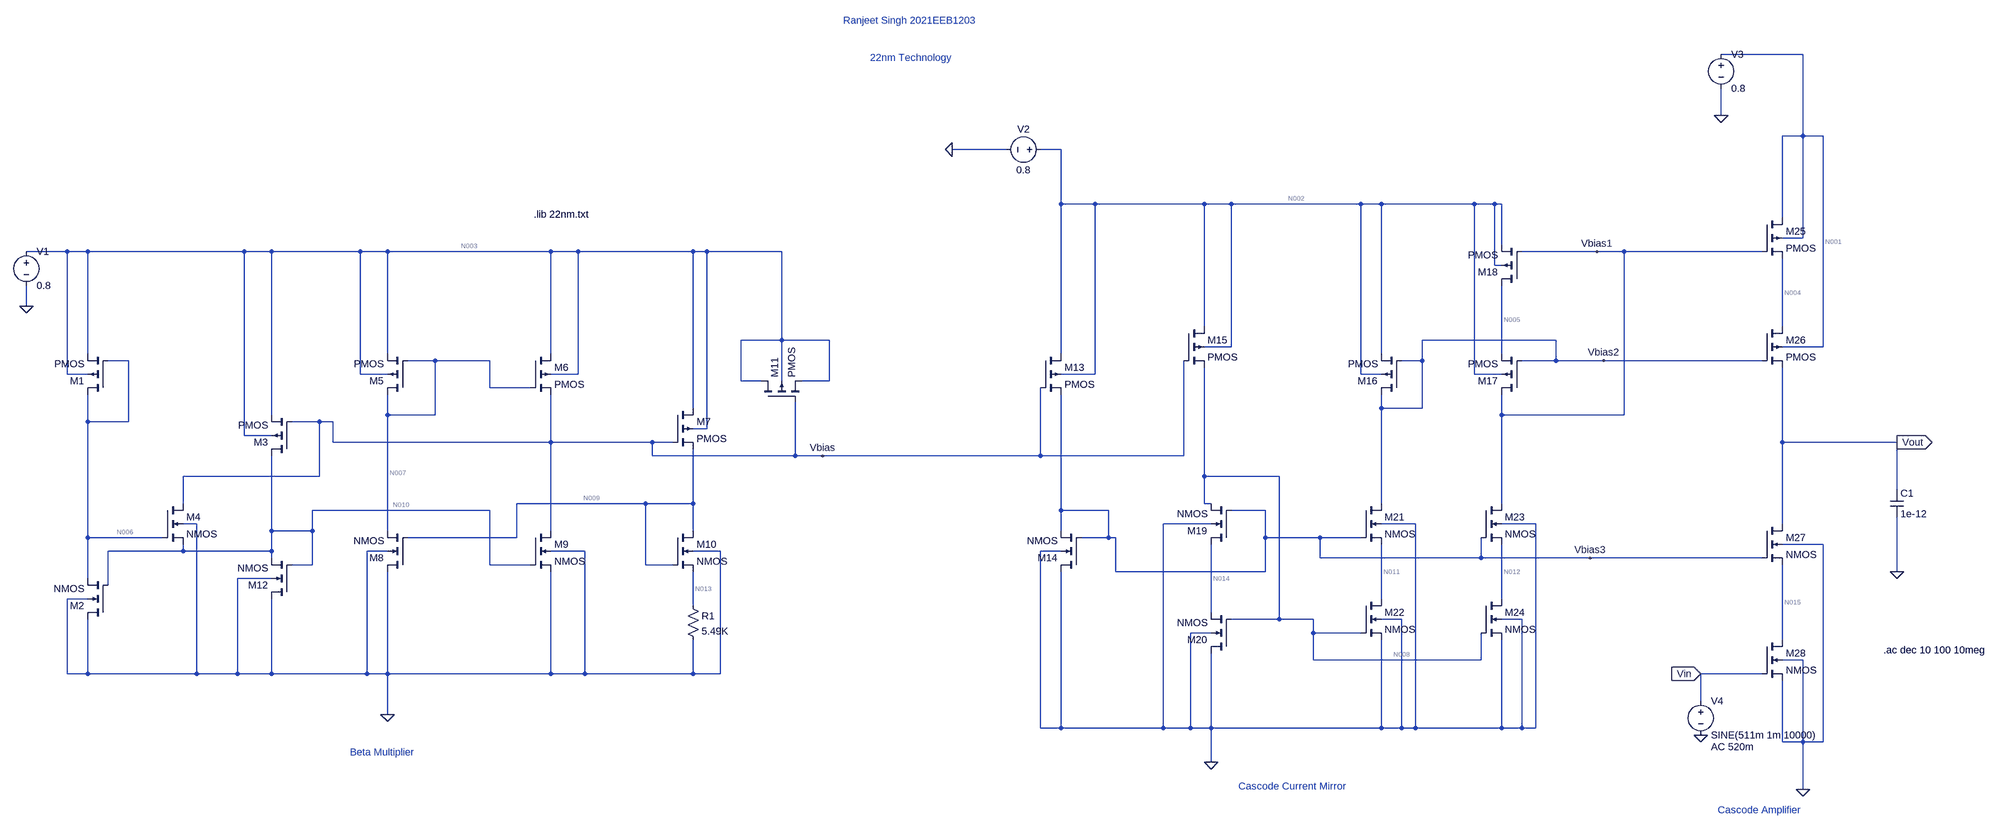
[diagram p0: schematic 22nm.asc]
22nm.asc, the LTspice schematic file:
Version 4
SHEET 1 3836 1104
WIRE 3344 -688 3152 -688
WIRE 3152 -544 3152 -608
WIRE 3344 -496 3344 -688
WIRE 3344 -496 3296 -496
WIRE 3392 -496 3344 -496
WIRE 1152 -464 1024 -464
WIRE 1280 -464 1232 -464
WIRE 1280 -336 1280 -464
WIRE 1360 -336 1280 -336
WIRE 1648 -336 1360 -336
WIRE 1712 -336 1648 -336
WIRE 2016 -336 1712 -336
WIRE 2064 -336 2016 -336
WIRE 2304 -336 2064 -336
WIRE 2352 -336 2304 -336
WIRE 2368 -336 2352 -336
WIRE 3296 -304 3296 -496
WIRE 3344 -256 3344 -496
WIRE 3344 -256 3296 -256
WIRE 2368 -240 2368 -336
WIRE -1104 -224 -1200 -224
WIRE -1056 -224 -1104 -224
WIRE -688 -224 -1056 -224
WIRE -624 -224 -688 -224
WIRE -416 -224 -624 -224
WIRE -352 -224 -416 -224
WIRE 32 -224 -352 -224
WIRE 96 -224 32 -224
WIRE 416 -224 96 -224
WIRE 448 -224 416 -224
WIRE 624 -224 448 -224
WIRE 2592 -224 2416 -224
WIRE 2656 -224 2592 -224
WIRE 3248 -224 2656 -224
WIRE 2352 -192 2352 -336
WIRE 2368 -192 2352 -192
WIRE -1200 -96 -1200 -144
WIRE 1648 -48 1648 -336
WIRE 3296 -48 3296 -208
WIRE 624 -16 624 -224
WIRE 624 -16 528 -16
WIRE 736 -16 624 -16
WIRE 2496 -16 2160 -16
WIRE 1712 0 1712 -336
WIRE 1712 0 1648 0
WIRE 3392 0 3392 -496
WIRE 3392 0 3296 0
WIRE -1056 16 -1056 -224
WIRE -352 16 -352 -224
WIRE 32 16 32 -224
WIRE 1280 16 1280 -336
WIRE 2064 16 2064 -336
WIRE 2368 16 2368 -144
WIRE -960 32 -1008 32
WIRE -240 32 -304 32
WIRE -112 32 -240 32
WIRE 2160 32 2160 -16
WIRE 2160 32 2112 32
WIRE 2496 32 2496 -16
WIRE 2496 32 2416 32
WIRE 2608 32 2496 32
WIRE 3248 32 2608 32
WIRE -1104 64 -1104 -224
WIRE -1056 64 -1104 64
WIRE -416 64 -416 -224
WIRE -352 64 -416 64
WIRE 96 64 96 -224
WIRE 96 64 32 64
WIRE 1360 64 1360 -336
WIRE 1360 64 1280 64
WIRE 2016 64 2016 -336
WIRE 2064 64 2016 64
WIRE 2304 64 2304 -336
WIRE 2368 64 2304 64
WIRE 528 80 528 -16
WIRE 576 80 528 80
WIRE 624 80 624 -16
WIRE 736 80 736 -16
WIRE 736 80 672 80
WIRE -112 96 -112 32
WIRE -16 96 -112 96
WIRE 416 144 416 -224
WIRE 2064 144 2064 112
WIRE 2160 144 2160 32
WIRE 2160 144 2064 144
WIRE -624 160 -624 -224
WIRE -352 160 -352 112
WIRE -240 160 -240 32
WIRE -240 160 -352 160
WIRE 2368 160 2368 112
WIRE 2656 160 2656 -224
WIRE 2656 160 2368 160
WIRE -1056 176 -1056 112
WIRE -960 176 -960 32
WIRE -960 176 -1056 176
WIRE -512 176 -576 176
WIRE -480 176 -512 176
WIRE 448 192 448 -224
WIRE 448 192 416 192
WIRE -688 208 -688 -224
WIRE -624 208 -688 208
WIRE -480 224 -480 176
WIRE 32 224 32 112
WIRE 32 224 -480 224
WIRE 320 224 32 224
WIRE 368 224 320 224
WIRE 3296 224 3296 48
WIRE 3600 224 3296 224
WIRE 320 256 320 224
WIRE 656 256 656 128
WIRE 656 256 320 256
WIRE 720 256 656 256
WIRE 1232 256 1232 96
WIRE 1232 256 720 256
WIRE 1600 256 1600 32
WIRE 1600 256 1232 256
WIRE -512 304 -512 176
WIRE -512 304 -832 304
WIRE 1648 304 1648 48
WIRE 1824 304 1648 304
WIRE 3600 336 3600 224
WIRE -832 368 -832 304
WIRE 304 368 -48 368
WIRE 416 368 416 240
WIRE 416 368 304 368
WIRE 1648 368 1648 304
WIRE 1664 368 1648 368
WIRE 2064 368 2064 144
WIRE 2368 368 2368 160
WIRE -112 384 -528 384
WIRE 1280 384 1280 112
WIRE 1392 384 1280 384
WIRE 1792 384 1712 384
WIRE -800 416 -832 416
WIRE 1664 416 1552 416
WIRE 2144 416 2064 416
WIRE 2448 416 2368 416
WIRE 3296 416 3296 224
WIRE -624 432 -624 256
WIRE -528 432 -528 384
WIRE -528 432 -624 432
WIRE -352 432 -352 160
WIRE 32 432 32 224
WIRE 416 432 416 368
WIRE 1280 432 1280 384
WIRE -1056 448 -1056 176
WIRE -880 448 -1056 448
WIRE -48 448 -48 368
WIRE -48 448 -304 448
WIRE 1392 448 1392 384
WIRE 1392 448 1328 448
WIRE 1408 448 1392 448
WIRE 1792 448 1792 384
WIRE 1920 448 1792 448
WIRE 2016 448 1920 448
WIRE 3392 464 3296 464
WIRE -832 480 -832 464
WIRE -832 480 -1008 480
WIRE -624 480 -624 432
WIRE -624 480 -832 480
WIRE -352 480 -400 480
WIRE 112 480 32 480
WIRE 480 480 416 480
WIRE 1280 480 1232 480
WIRE -624 496 -624 480
WIRE 1920 496 1920 448
WIRE 2320 496 2320 448
WIRE 2320 496 1920 496
WIRE 2576 496 2320 496
WIRE 3248 496 2576 496
WIRE -528 512 -528 432
WIRE -528 512 -576 512
WIRE -112 512 -112 384
WIRE -16 512 -112 512
WIRE 304 512 304 368
WIRE 368 512 304 512
WIRE 1408 528 1408 448
WIRE 1792 528 1792 448
WIRE 1792 528 1408 528
WIRE 3600 528 3600 400
WIRE -1056 544 -1056 448
WIRE -624 544 -704 544
WIRE -1008 560 -1008 480
WIRE -1056 592 -1104 592
WIRE 2064 592 2064 464
WIRE 2368 592 2368 464
WIRE 416 608 416 528
WIRE 1664 624 1664 464
WIRE 1824 640 1824 304
WIRE 1824 640 1712 640
WIRE 1904 640 1824 640
WIRE 2112 640 2064 640
WIRE 2416 640 2368 640
WIRE 1664 672 1616 672
WIRE 1904 672 1904 640
WIRE 2016 672 1904 672
WIRE 3296 688 3296 512
WIRE 1904 736 1904 672
WIRE 2320 736 2320 672
WIRE 2320 736 1904 736
WIRE 3344 736 3296 736
WIRE -1104 768 -1104 592
WIRE -1056 768 -1056 640
WIRE -1056 768 -1104 768
WIRE -800 768 -800 416
WIRE -800 768 -1056 768
WIRE -704 768 -704 544
WIRE -704 768 -800 768
WIRE -624 768 -624 592
WIRE -624 768 -704 768
WIRE -400 768 -400 480
WIRE -400 768 -624 768
WIRE -352 768 -352 528
WIRE -352 768 -400 768
WIRE 32 768 32 528
WIRE 32 768 -352 768
WIRE 112 768 112 480
WIRE 112 768 32 768
WIRE 416 768 416 688
WIRE 416 768 112 768
WIRE 480 768 480 480
WIRE 480 768 416 768
WIRE 3248 768 3104 768
WIRE 3104 832 3104 768
WIRE -352 864 -352 768
WIRE 1232 896 1232 480
WIRE 1280 896 1280 528
WIRE 1280 896 1232 896
WIRE 1552 896 1552 416
WIRE 1552 896 1280 896
WIRE 1616 896 1616 672
WIRE 1616 896 1552 896
WIRE 1664 896 1664 720
WIRE 1664 896 1616 896
WIRE 2064 896 2064 688
WIRE 2064 896 1664 896
WIRE 2112 896 2112 640
WIRE 2112 896 2064 896
WIRE 2144 896 2144 416
WIRE 2144 896 2112 896
WIRE 2368 896 2368 688
WIRE 2368 896 2144 896
WIRE 2416 896 2416 640
WIRE 2416 896 2368 896
WIRE 2448 896 2448 416
WIRE 2448 896 2416 896
WIRE 3296 928 3296 784
WIRE 3344 928 3344 736
WIRE 3344 928 3296 928
WIRE 3392 928 3392 464
WIRE 3392 928 3344 928
WIRE 1664 976 1664 896
WIRE 3344 1040 3344 928
FLAG -1200 -96 0
FLAG -352 864 0
FLAG 720 256 Vbias
FLAG 2592 -224 Vbias1
FLAG 2608 32 Vbias2
FLAG 2576 496 Vbias3
FLAG 1024 -464 0
FLAG 1664 976 0
FLAG 3600 528 0
FLAG 3344 1040 0
FLAG 3152 -544 0
FLAG 3104 912 0
FLAG 3600 224 Vout
IOPIN 3600 224 Out
FLAG 3104 768 Vin
IOPIN 3104 768 In
DATAFLAG 1968 496 ""
DATAFLAG 2848 32 ""
DATAFLAG 2896 -224 ""
DATAFLAG 2928 496 ""
DATAFLAG 1232 752 ""
DATAFLAG 3296 -112 ""
DATAFLAG 3296 304 ""
DATAFLAG 3296 608 ""
DATAFLAG 3184 768 ""
DATAFLAG 976 256 ""
DATAFLAG 3344 -608 ""
SYMBOL pmos4 -1008 112 R180
SYMATTR InstName M1
SYMATTR Value2 l=440n w=220n
SYMBOL nmos4 -1008 640 R180
SYMATTR InstName M2
SYMATTR Value2 l=44n w=220n
SYMBOL pmos4 -576 256 R180
SYMATTR InstName M3
SYMATTR Value2 l=44n w=528n
SYMBOL nmos4 -880 368 R0
SYMATTR InstName M4
SYMATTR Value2 l=44n w=88n
SYMBOL pmos4 -304 112 R180
SYMATTR InstName M5
SYMATTR Value2 l=44n w=528n
SYMBOL pmos4 -16 16 R0
SYMATTR InstName M6
SYMATTR Value2 l=44n w=528n
SYMBOL pmos4 368 144 R0
SYMATTR InstName M7
SYMATTR Value2 l=44n w=528n
SYMBOL nmos4 -304 528 R180
SYMATTR InstName M8
SYMATTR Value2 l=44n w=220n
SYMBOL nmos4 -16 432 R0
SYMATTR InstName M9
SYMATTR Value2 l=44n w=220n
SYMBOL nmos4 368 432 R0
SYMATTR InstName M10
SYMATTR Value2 l=44n w=660n
SYMBOL pmos4 576 128 R270
SYMATTR InstName M11
SYMBOL nmos4 -576 592 R180
SYMATTR InstName M12
SYMATTR Value2 l=44n w=220n
SYMBOL voltage -1200 -240 R0
WINDOW 123 0 0 Left 0
WINDOW 39 0 0 Left 0
SYMATTR InstName V1
SYMATTR Value 0.8
SYMBOL res 400 592 R0
SYMATTR InstName R1
SYMATTR Value 5.49K
SYMATTR SpiceLine tol=1 pwr=0.1
SYMBOL pmos4 1232 16 R0
SYMATTR InstName M13
SYMATTR Value2 l=44n w=528n
SYMBOL nmos4 1328 528 R180
SYMATTR InstName M14
SYMATTR Value2 l=44n w=110n
SYMBOL pmos4 1600 -48 R0
SYMATTR InstName M15
SYMATTR Value2 l=44n w=528n
SYMBOL pmos4 2112 112 R180
SYMATTR InstName M16
SYMATTR Value2 l=110n w=440n
SYMBOL pmos4 2416 112 R180
SYMATTR InstName M17
SYMATTR Value2 l=44n w=528n
SYMBOL pmos4 2416 -144 R180
SYMATTR InstName M18
SYMATTR Value2 l=44n w=528n
SYMBOL nmos4 1712 464 R180
SYMATTR InstName M19
SYMATTR Value2 l=44n w=220n
SYMBOL nmos4 1712 720 R180
SYMATTR InstName M20
SYMATTR Value2 l=44n w=220n
SYMBOL nmos4 2016 368 R0
SYMATTR InstName M21
SYMATTR Value2 l=44n w=220n
SYMBOL nmos4 2016 592 R0
SYMATTR InstName M22
SYMATTR Value2 l=44n w=220n
SYMBOL nmos4 2320 368 R0
SYMATTR InstName M23
SYMATTR Value2 l=44n w=220n
SYMBOL nmos4 2320 592 R0
SYMATTR InstName M24
SYMATTR Value2 l=44n w=220n
SYMBOL voltage 1248 -464 R90
WINDOW 0 -32 56 VBottom 2
WINDOW 3 32 56 VTop 2
WINDOW 123 0 0 Left 0
WINDOW 39 0 0 Left 0
SYMATTR InstName V2
SYMATTR Value 0.8
SYMBOL pmos4 3248 -304 R0
SYMATTR InstName M25
SYMATTR Value2 l=44n w=572n
SYMBOL pmos4 3248 -48 R0
SYMATTR InstName M26
SYMATTR Value2 l=44n w=594n
SYMBOL nmos4 3248 416 R0
SYMATTR InstName M27
SYMATTR Value2 l=44n w=462n
SYMBOL nmos4 3248 688 R0
SYMATTR InstName M28
SYMATTR Value2 l=44n w=462n
SYMBOL cap 3584 336 R0
SYMATTR InstName C1
SYMATTR Value 1e-12
SYMBOL voltage 3152 -704 R0
WINDOW 123 0 0 Left 0
WINDOW 39 0 0 Left 0
SYMATTR InstName V3
SYMATTR Value 0.8
SYMBOL voltage 3104 816 R0
WINDOW 123 24 124 Left 2
WINDOW 39 0 0 Left 0
SYMATTR Value2 AC 520m
SYMATTR InstName V4
SYMATTR Value SINE(511m 1m 10000)
TEXT -8 -312 Left 2 !.lib 22nm.txt
TEXT 3568 712 Left 2 !.ac dec 10 100 10meg
TEXT 832 -680 Left 2 ;22nm Technology
TEXT 768 -768 Left 2 ;Ranjeet Singh 2021EEB1203
TEXT -440 952 Left 2 ;Beta Multiplier
TEXT 1728 1032 Left 2 ;Cascode Current Mirror
TEXT 3144 1088 Left 2 ;Cascode Amplifier

The netlist it stands for:
* 22nm.asc
M1 N006 N006 N003 N003 PMOS l=440n w=220n
M2 0 N010 N006 0 NMOS l=44n w=220n
M3 N010 Vbias N003 N003 PMOS l=44n w=528n
M4 Vbias N006 N010 0 NMOS l=44n w=88n
M5 N007 N007 N003 N003 PMOS l=44n w=528n
M6 N003 N007 Vbias N003 PMOS l=44n w=528n
M7 N003 Vbias N009 N003 PMOS l=44n w=528n
M8 0 N009 N007 0 NMOS l=44n w=220n
M9 Vbias N010 0 0 NMOS l=44n w=220n
M10 N009 N009 N013 0 NMOS l=44n w=660n
M11 N003 Vbias N003 N003 PMOS
M12 0 N010 N010 0 NMOS l=44n w=220n
V1 N003 0 0.8
R1 N013 0 5.49K tol=1 pwr=0.1
M13 N002 Vbias Vbias3 N002 PMOS l=44n w=528n
M14 0 Vbias3 Vbias3 0 NMOS l=44n w=110n
M15 N002 Vbias N008 N002 PMOS l=44n w=528n
M16 Vbias2 Vbias2 N002 N002 PMOS l=110n w=440n
M17 Vbias1 Vbias2 N005 N002 PMOS l=44n w=528n
M18 N005 Vbias1 N002 N002 PMOS l=44n w=528n
M19 N014 Vbias3 N008 0 NMOS l=44n w=220n
M20 0 N008 N014 0 NMOS l=44n w=220n
M21 Vbias2 Vbias3 N011 0 NMOS l=44n w=220n
M22 N011 N008 0 0 NMOS l=44n w=220n
M23 Vbias1 Vbias3 N012 0 NMOS l=44n w=220n
M24 N012 N008 0 0 NMOS l=44n w=220n
V2 N002 0 0.8
M25 N001 Vbias1 N004 N001 PMOS l=44n w=572n
M26 N004 Vbias2 Vout N001 PMOS l=44n w=594n
M27 Vout Vbias3 N015 0 NMOS l=44n w=462n
M28 N015 Vin 0 0 NMOS l=44n w=462n
C1 Vout 0 1e-12
V3 N001 0 0.8
V4 Vin 0 SINE(511m 1m 10000) AC 520m
.model NMOS NMOS
.model PMOS PMOS
.lib standard.mos
.lib 22nm.txt
.ac dec 10 100 10meg
* 22nm Technology
* Ranjeet Singh 2021EEB1203
* Beta Multiplier
* Cascode Current Mirror
* Cascode Amplifier
.backanno
.end

* Results of the author's LTspice run, read from the files saved beside the schematic
* Operating Point, zero values left out:
*   V(n006) = 14.65 mV
*   V(n003) = 800 mV
*   V(n010) = 540 mV
*   V(vbias) = 248.3 mV
*   V(n007) = 265.6 mV
*   V(n009) = 539.1 mV
*   V(n013) = 52.73 mV
*   V(n002) = 800 mV
*   V(vbias3) = 592.1 mV
*   V(n008) = 599.4 mV
*   V(vbias2) = 138.6 mV
*   V(vbias1) = 239.5 mV
*   V(n005) = 697 mV
*   V(n014) = 44.83 mV
*   V(n011) = 38.36 mV
*   V(n012) = 41.12 mV
*   V(n001) = 800 mV
*   V(n004) = 694.4 mV
*   V(vout) = 195.2 mV
*   V(n015) = 72.24 mV
*   V(vin) = 511 mV
*   Id(M28) = 9.475 µA
*   Ig(M28) = 22.66 pA
*   Is(M28) = -9.475 µA
*   Id(M27) = 9.475 µA
*   Ig(M27) = 24.42 pA
*   Is(M27) = -9.475 µA
*   Id(M24) = 8.632 µA
*   Ig(M24) = 37.53 pA
*   Is(M24) = -8.632 µA
*   Id(M23) = 8.632 µA
*   Ig(M23) = 17.46 pA
*   Is(M23) = -8.632 µA
*   Id(M22) = 8.153 µA
*   Ig(M22) = 37.66 pA
*   Is(M22) = -8.153 µA
*   Id(M21) = 8.153 µA
*   Ig(M21) = 19.75 pA
*   Is(M21) = -8.153 µA
*   Id(M20) = -9.255 µA
*   Ig(M20) = 37.37 pA
*   Is(M20) = 9.255 µA
*   Id(M19) = -9.255 µA
*   Ig(M19) = 15.48 pA
*   Is(M19) = 9.255 µA
*   Id(M14) = -9.304 µA
*   Ig(M14) = 13.72 pA
*   Is(M14) = 9.304 µA
*   Id(M12) = -9.6 µA
*   Ig(M12) = 13.71 pA
*   Is(M12) = 9.6 µA
*   Id(M10) = 9.605 µA
*   Ig(M10) = 16.37 pA
*   Is(M10) = -9.605 µA
*   Id(M9) = 8.605 µA
*   Ig(M9) = 14.21 pA
*   Is(M9) = -8.605 µA
*   Id(M8) = -8.537 µA
*   Ig(M8) = 13.87 pA
*   Is(M8) = 8.537 µA
*   Id(M4) = 1.069 pA
*   Ig(M4) = -6.523 pA
*   Is(M4) = 6.253 pA
*   Id(M2) = -2.042 µA
*   Ig(M2) = 18.28 pA
*   Is(M2) = 2.042 µA
*   Id(M26) = 9.475 µA
*   Is(M26) = -9.475 µA
*   Id(M25) = 9.475 µA
*   Is(M25) = -9.475 µA
*   Id(M18) = -8.632 µA
*   Is(M18) = 8.632 µA
*   Id(M17) = -8.632 µA
*   Is(M17) = 8.632 µA
*   Id(M16) = -8.153 µA
*   Ig(M16) = -2.752 pA
*   Ib(M16) = 3.414 pA
*   Is(M16) = 8.153 µA
*   Id(M15) = 9.255 µA
*   Is(M15) = -9.255 µA
*   Id(M13) = 9.304 µA
*   Is(M13) = -9.304 µA
*   Id(M11) = 1.153 pA
*   Ig(M11) = -227.2 pA
*   Ib(M11) = 224.9 pA
*   Is(M11) = 1.153 pA
*   Id(M7) = 9.605 µA
*   Is(M7) = -9.605 µA
*   Id(M6) = 8.605 µA
*   Is(M6) = -8.605 µA
*   Id(M5) = -8.537 µA
*   Is(M5) = 8.537 µA
*   Id(M3) = -9.6 µA
*   Is(M3) = 9.6 µA
*   Id(M1) = -2.042 µA
*   Ig(M1) = -58.2 pA
*   Ib(M1) = 58.91 pA
*   Is(M1) = 2.042 µA
*   I(R1) = 9.605 µA
*   I(V4) = -22.66 pA
*   I(V3) = -9.475 µA
*   I(V2) = -35.34 µA
*   I(V1) = -38.39 µA
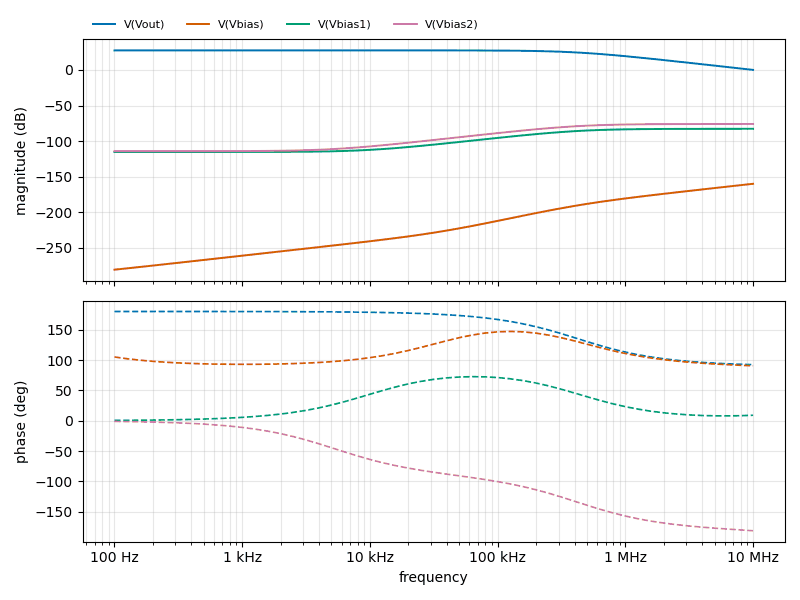
[diagram p1: AC Analysis of 22nm.asc, plotted from the saved traces]
* AC Analysis, 1 run:
*   V(Vout): 27.55 dB at 100 Hz, 0.14 dB at 10 MHz, peak 27.55 dB at 100 Hz, 3 dB below the peak at 423.9 kHz
*   V(Vbias): -280.90 dB at 100 Hz, -160.08 dB at 10 MHz, peak -160.08 dB at 10 MHz, 3 dB below the peak at 7.049 MHz
*   V(Vbias1): -115.33 dB at 100 Hz, -82.71 dB at 10 MHz, peak -82.71 dB at 10 MHz, 3 dB below the peak at 433.1 kHz
*   V(Vbias2): -114.18 dB at 100 Hz, -75.93 dB at 10 MHz, peak -75.93 dB at 10 MHz, 3 dB below the peak at 429.9 kHz